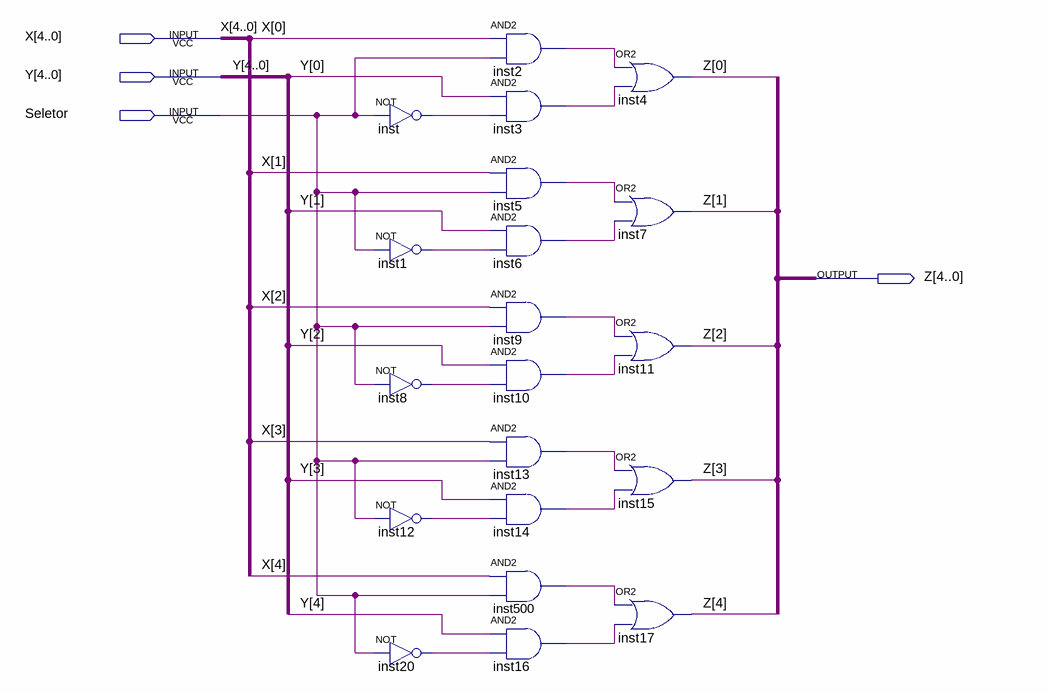
[diagram p0: schematic sheet]
// Quartus schematic MUX_21_5bit.bdf as structural Verilog: 20 symbols, 4 pins
module MUX_21_5bit (
  input  [4:0] X,
  input  [4:0] Y,
  input  Seletor,
  output [4:0] Z
);

  wire inst1_out, inst2_out, inst3_out, inst5_out, inst6_out, inst8_out, inst9_out, inst10_out, inst12_out,
       inst13_out, inst14_out, inst16_out, inst20_out, inst500_out, inst_out;

  not inst (inst_out, Seletor);
  not inst1 (inst1_out, Seletor);
  not inst8 (inst8_out, Seletor);
  not inst12 (inst12_out, Seletor);
  not inst20 (inst20_out, Seletor);
  and inst2 (inst2_out, X[0], Seletor);
  and inst3 (inst3_out, Y[0], inst_out);
  and inst5 (inst5_out, X[1], Seletor);
  and inst6 (inst6_out, Y[1], inst1_out);
  and inst9 (inst9_out, X[2], Seletor);
  and inst10 (inst10_out, Y[2], inst8_out);
  and inst13 (inst13_out, X[3], Seletor);
  and inst14 (inst14_out, Y[3], inst12_out);
  and inst500 (inst500_out, X[4], Seletor);
  and inst16 (inst16_out, Y[4], inst20_out);
  or inst4 (Z[0], inst2_out, inst3_out);
  or inst7 (Z[1], inst5_out, inst6_out);
  or inst11 (Z[2], inst9_out, inst10_out);
  or inst15 (Z[3], inst13_out, inst14_out);
  or inst17 (Z[4], inst500_out, inst16_out);
endmodule
